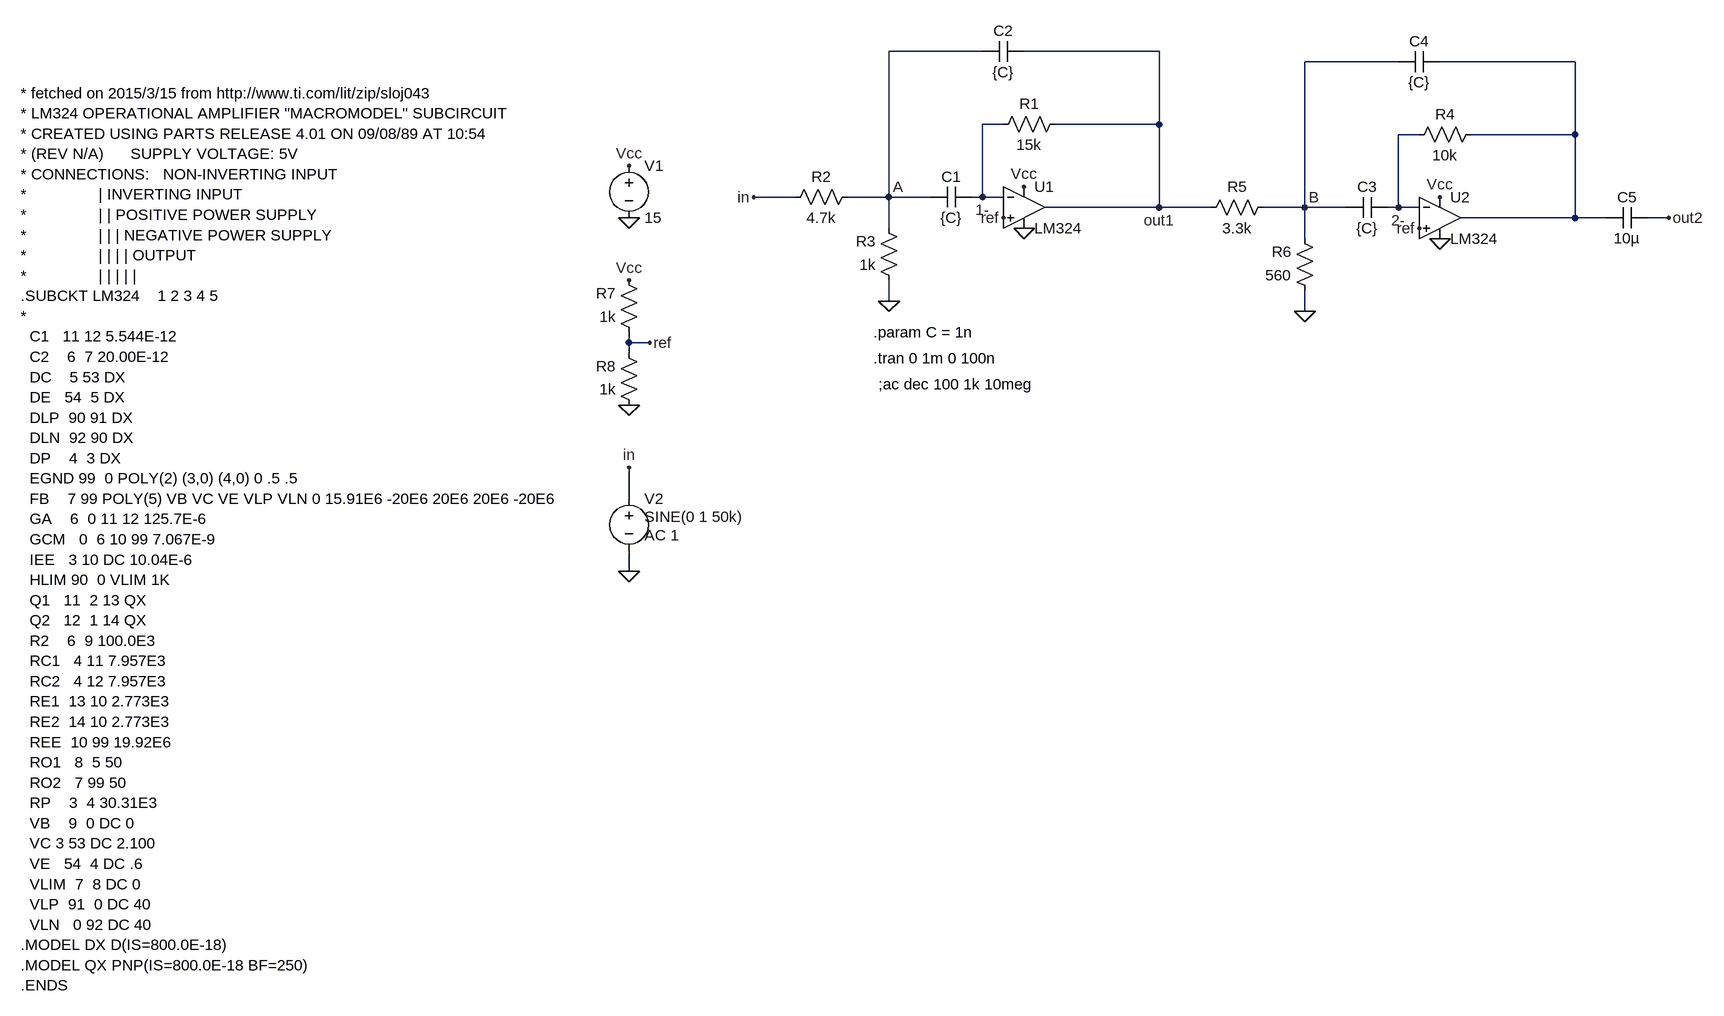
[diagram p0: schematic bandpass.asc]
bandpass.asc, the LTspice schematic file:
Version 4
SHEET 1 1400 1264
WIRE 272 -48 128 -48
WIRE 544 -48 336 -48
WIRE 912 -32 768 -32
WIRE 1184 -32 976 -32
WIRE 304 64 272 64
WIRE 544 64 544 -48
WIRE 544 64 384 64
WIRE 944 80 912 80
WIRE 1184 80 1184 -32
WIRE 1184 80 1024 80
WIRE -16 176 -80 176
WIRE 128 176 128 -48
WIRE 128 176 64 176
WIRE 192 176 128 176
WIRE 272 176 272 64
WIRE 272 176 256 176
WIRE 304 176 272 176
WIRE 544 192 544 64
WIRE 544 192 368 192
WIRE 624 192 544 192
WIRE 768 192 768 -32
WIRE 768 192 704 192
WIRE 832 192 768 192
WIRE 912 192 912 80
WIRE 912 192 896 192
WIRE 944 192 912 192
WIRE 1184 208 1184 80
WIRE 1184 208 1008 208
WIRE 1232 208 1184 208
WIRE 1328 208 1296 208
WIRE 128 224 128 176
WIRE 768 240 768 192
WIRE 128 336 128 304
WIRE 768 352 768 320
WIRE -272 400 -272 384
WIRE -240 400 -272 400
WIRE -272 416 -272 400
WIRE -272 640 -272 592
WIRE -272 752 -272 720
FLAG -272 208 0
FLAG -272 128 Vcc
FLAG 336 224 0
FLAG 336 160 Vcc
FLAG -272 752 0
FLAG 128 336 0
FLAG 976 240 0
FLAG 976 176 Vcc
FLAG 768 352 0
FLAG 1328 208 out2
FLAG 544 192 out1
FLAG -272 592 in
FLAG 304 208 ref
FLAG 944 224 ref
FLAG -272 496 0
FLAG -272 304 Vcc
FLAG -240 400 ref
FLAG 128 176 A
FLAG 768 192 B
FLAG 272 176 1-
FLAG 912 192 2-
FLAG -80 176 in
SYMBOL voltage -272 112 R0
WINDOW 123 0 0 Left 0
WINDOW 39 0 0 Left 0
SYMATTR InstName V1
SYMATTR Value 15
SYMBOL OpAmps\\opamp2 336 128 R0
SYMATTR InstName U1
SYMATTR Value LM324
SYMBOL cap 256 160 R90
WINDOW 0 0 32 VBottom 2
WINDOW 3 32 32 VTop 2
SYMATTR InstName C1
SYMATTR Value {C}
SYMBOL cap 336 -64 R90
WINDOW 0 0 32 VBottom 2
WINDOW 3 32 32 VTop 2
SYMATTR InstName C2
SYMATTR Value {C}
SYMBOL res 400 48 R90
WINDOW 0 0 56 VBottom 2
WINDOW 3 32 56 VTop 2
SYMATTR InstName R1
SYMATTR Value 15k
SYMBOL res 80 160 R90
WINDOW 0 0 56 VBottom 2
WINDOW 3 32 56 VTop 2
SYMATTR InstName R2
SYMATTR Value 4.7k
SYMBOL res 144 320 R180
WINDOW 0 36 76 Left 2
WINDOW 3 36 40 Left 2
SYMATTR InstName R3
SYMATTR Value 1k
SYMBOL voltage -272 624 R0
WINDOW 3 24 44 Left 2
WINDOW 123 24 72 Left 2
WINDOW 39 0 0 Left 0
SYMATTR Value SINE(0 1 50k)
SYMATTR Value2 AC 1
SYMATTR InstName V2
SYMBOL OpAmps\\opamp2 976 144 R0
SYMATTR InstName U2
SYMATTR Value LM324
SYMBOL cap 896 176 R90
WINDOW 0 0 32 VBottom 2
WINDOW 3 32 32 VTop 2
SYMATTR InstName C3
SYMATTR Value {C}
SYMBOL cap 976 -48 R90
WINDOW 0 0 32 VBottom 2
WINDOW 3 32 32 VTop 2
SYMATTR InstName C4
SYMATTR Value {C}
SYMBOL res 1040 64 R90
WINDOW 0 0 56 VBottom 2
WINDOW 3 32 56 VTop 2
SYMATTR InstName R4
SYMATTR Value 10k
SYMBOL res 720 176 R90
WINDOW 0 0 56 VBottom 2
WINDOW 3 32 56 VTop 2
SYMATTR InstName R5
SYMATTR Value 3.3k
SYMBOL res 784 336 R180
WINDOW 0 36 76 Left 2
WINDOW 3 36 40 Left 2
SYMATTR InstName R6
SYMATTR Value 560
SYMBOL res -256 400 R180
WINDOW 0 36 76 Left 2
WINDOW 3 36 40 Left 2
SYMATTR InstName R7
SYMATTR Value 1k
SYMBOL res -256 512 R180
WINDOW 0 36 76 Left 2
WINDOW 3 36 40 Left 2
SYMATTR InstName R8
SYMATTR Value 1k
SYMBOL cap 1296 192 R90
WINDOW 0 0 32 VBottom 2
WINDOW 3 32 32 VTop 2
SYMATTR InstName C5
SYMATTR Value 10µ
TEXT -1208 16 Left 2 !* fetched on 2015/3/15 from http://www.ti.com/lit/zip/sloj043\n* LM324 OPERATIONAL AMPLIFIER "MACROMODEL" SUBCIRCUIT\n* CREATED USING PARTS RELEASE 4.01 ON 09/08/89 AT 10:54\n* (REV N/A)      SUPPLY VOLTAGE: 5V\n* CONNECTIONS:   NON-INVERTING INPUT\n*                | INVERTING INPUT\n*                | | POSITIVE POWER SUPPLY\n*                | | | NEGATIVE POWER SUPPLY\n*                | | | | OUTPUT\n*                | | | | |\n.SUBCKT LM324    1 2 3 4 5\n*\n  C1   11 12 5.544E-12\n  C2    6  7 20.00E-12\n  DC    5 53 DX\n  DE   54  5 DX\n  DLP  90 91 DX\n  DLN  92 90 DX\n  DP    4  3 DX\n  EGND 99  0 POLY(2) (3,0) (4,0) 0 .5 .5\n  FB    7 99 POLY(5) VB VC VE VLP VLN 0 15.91E6 -20E6 20E6 20E6 -20E6\n  GA    6  0 11 12 125.7E-6\n  GCM   0  6 10 99 7.067E-9\n  IEE   3 10 DC 10.04E-6\n  HLIM 90  0 VLIM 1K\n  Q1   11  2 13 QX\n  Q2   12  1 14 QX\n  R2    6  9 100.0E3\n  RC1   4 11 7.957E3\n  RC2   4 12 7.957E3\n  RE1  13 10 2.773E3\n  RE2  14 10 2.773E3\n  REE  10 99 19.92E6\n  RO1   8  5 50\n  RO2   7 99 50\n  RP    3  4 30.31E3\n  VB    9  0 DC 0\n  VC 3 53 DC 2.100\n  VE   54  4 DC .6\n  VLIM  7  8 DC 0\n  VLP  91  0 DC 40\n  VLN   0 92 DC 40\n.MODEL DX D(IS=800.0E-18)\n.MODEL QX PNP(IS=800.0E-18 BF=250)\n.ENDS
TEXT 112 464 Left 2 !;ac dec 100 1k 10meg
TEXT 104 424 Left 2 !.tran 0 1m 0 100n
TEXT 104 384 Left 2 !.param C = 1n

The netlist it stands for:
* bandpass.asc
V1 Vcc 0 15
XU1 ref 1- Vcc 0 out1 LM324  ; pins In+ In- V+ V- OUT
C1 1- A {C}
C2 out1 A {C}
R1 out1 1- 15k
R2 A in 4.7k
R3 0 A 1k
V2 in 0 SINE(0 1 50k) AC 1
XU2 ref 2- Vcc 0 N001 LM324  ; pins In+ In- V+ V- OUT
C3 2- B {C}
C4 N001 B {C}
R4 N001 2- 10k
R5 B out1 3.3k
R6 0 B 560
R7 ref Vcc 1k
R8 0 ref 1k
C5 out2 N001 10µ
* fetched on 2015/3/15 from http://www.ti.com/lit/zip/sloj043
* LM324 OPERATIONAL AMPLIFIER "MACROMODEL" SUBCIRCUIT
* CREATED USING PARTS RELEASE 4.01 ON 09/08/89 AT 10:54
* (REV N/A)      SUPPLY VOLTAGE: 5V
* CONNECTIONS:   NON-INVERTING INPUT
*                | INVERTING INPUT
*                | | POSITIVE POWER SUPPLY
*                | | | NEGATIVE POWER SUPPLY
*                | | | | OUTPUT
*                | | | | |
.SUBCKT LM324    1 2 3 4 5
*
  C1   11 12 5.544E-12
  C2    6  7 20.00E-12
  DC    5 53 DX
  DE   54  5 DX
  DLP  90 91 DX
  DLN  92 90 DX
  DP    4  3 DX
  EGND 99  0 POLY(2) (3,0) (4,0) 0 .5 .5
  FB    7 99 POLY(5) VB VC VE VLP VLN 0 15.91E6 -20E6 20E6 20E6 -20E6
  GA    6  0 11 12 125.7E-6
  GCM   0  6 10 99 7.067E-9
  IEE   3 10 DC 10.04E-6
  HLIM 90  0 VLIM 1K
  Q1   11  2 13 QX
  Q2   12  1 14 QX
  R2    6  9 100.0E3
  RC1   4 11 7.957E3
  RC2   4 12 7.957E3
  RE1  13 10 2.773E3
  RE2  14 10 2.773E3
  REE  10 99 19.92E6
  RO1   8  5 50
  RO2   7 99 50
  RP    3  4 30.31E3
  VB    9  0 DC 0
  VC 3 53 DC 2.100
  VE   54  4 DC .6
  VLIM  7  8 DC 0
  VLP  91  0 DC 40
  VLN   0 92 DC 40
.MODEL DX D(IS=800.0E-18)
.MODEL QX PNP(IS=800.0E-18 BF=250)
.ENDS
;ac dec 100 1k 10meg
.tran 0 1m 0 100n
.param C = 1n
.backanno
.end